# Altium schematic sheet 1.SchDoc
size A3; Author: Sofian Jafar; Engineer: Sofian Jafar; DocumentNumber: 1; Revision: 1.0; SheetNumber: 1; SheetTotal: 1; Descripition: HV+Pulser Board; SheetDescription: UltraSound Pulser
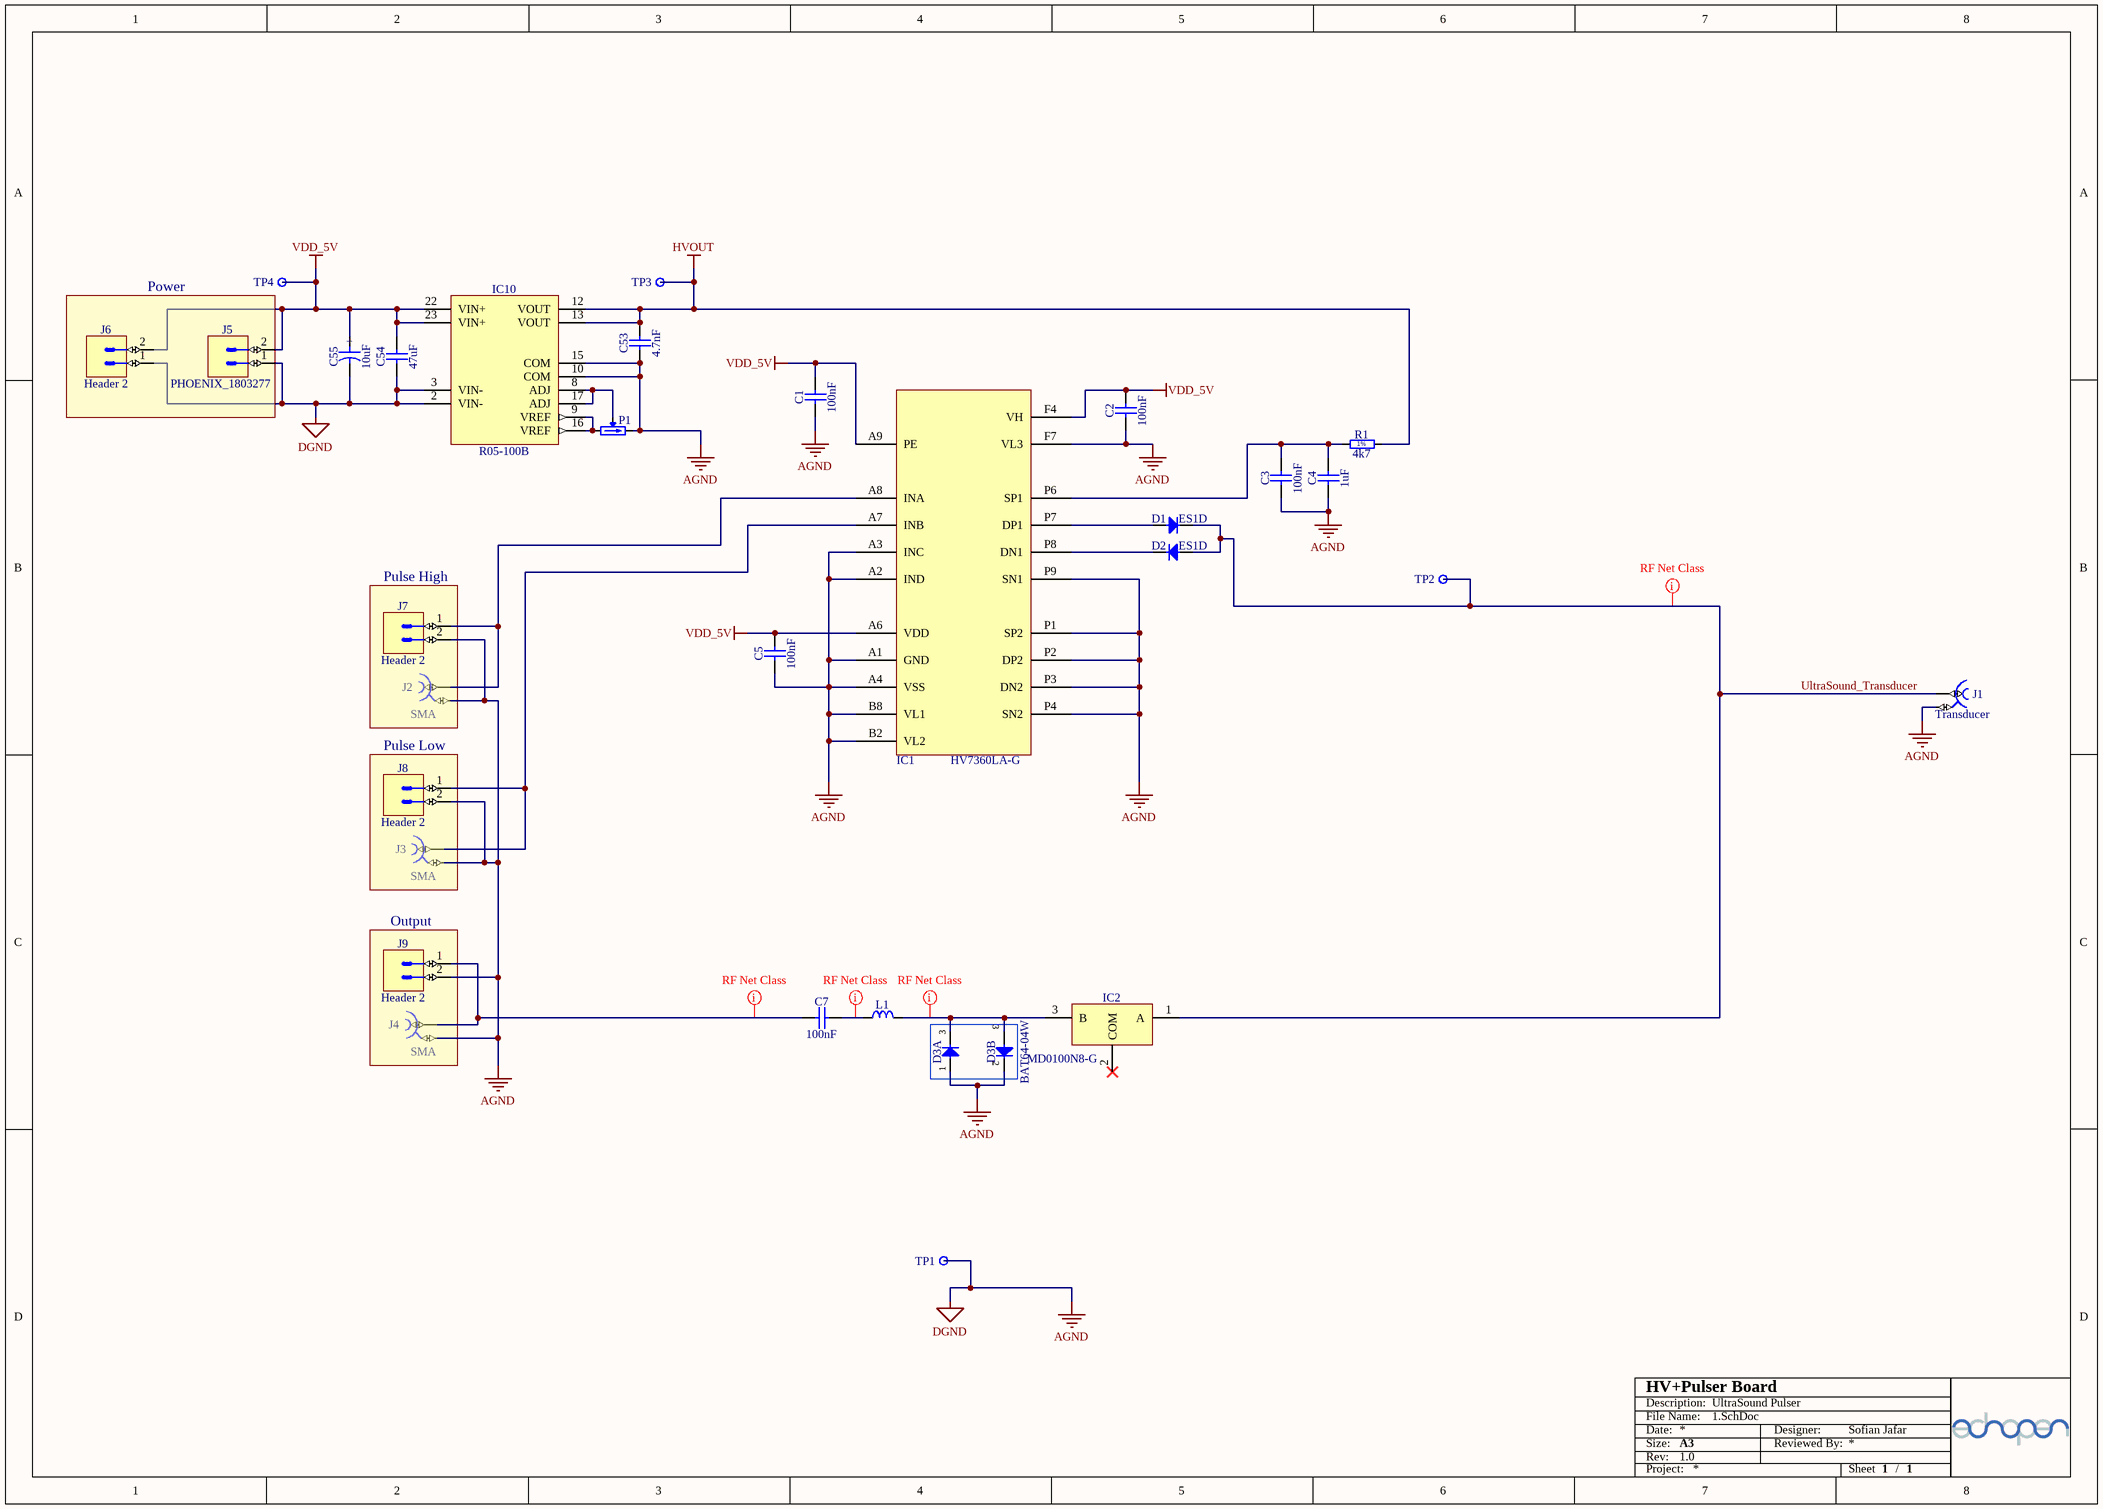
[diagram p0: 1.SchDoc]

## Parts
C1  100nF  [CAPC1608X87N]
C2  100nF  [CAPC1608X87N]
C3  100nF  [CAPC1608X87N]
C4  1uF  [CAPC5650X165N]
C5  100nF  [CAPC1608X87N]
C7  100nF  [CAPC1608X87N]
C53  4.7nF  [CAPC2012X110N]
C54  47uF  [CAPC3216X180N]
C55  10uF  [CAPMP3528X210N]
D1  ES1D  [DIOM5027X244N]
D2  ES1D  [DIOM5027X244N]
D3  BAT64-04W  [SOT65P210X100-3N]  (parts A,B of 2)
IC1  HV7360LA-G  [HV7360]
IC2  MD0100N8-G  [SOT89]
IC10  R05-100B  [PWS_RECOM_R05-100B]
J1  Transducer  [AMPHENOL_132357-11]
J2  SMA  [AMPHENOL_132357-11]
J3  SMA  [AMPHENOL_132357-11]
J4  SMA  [AMPHENOL_132357-11]
J5  PHOENIX_1803277  [PHOENIX_1803277]
J6  Header 2  [HARWIN_M20-9990246]
J7  Header 2  [HARWIN_M20-9990246]
J8  Header 2  [HARWIN_M20-9990246]
J9  Header 2  [HARWIN_M20-9990246]
L1  75R@100MHz  [INDC2012X105N]  (value not drawn)
P1  5k  [TRIM_BOURNS_3223W]  (value not drawn)
R1  4k7  [RESC3216X65N]
TP1  Test Point  [NICOMATIC_C12000B]  (value not drawn)
TP2  Test Point  [NICOMATIC_C12000B]  (value not drawn)
TP3  Test Point  [NICOMATIC_C12000B]  (value not drawn)
TP4  Test Point  [NICOMATIC_C12000B]  (value not drawn)

## Blocks framed on the sheet
Power: J5 J6
Pulse High: J2 J7
Pulse Low: J3 J8
Output: J4 J9

## Nets
AGND: C1.1 C2.1 C3.1 C4.1 C5.1 C53.1 C54.1 C55.2 D3.1(A) D3.2(C) IC1.A1(GND) IC1.A2(IND) IC1.A3(INC) IC1.A4(VSS) IC1.B2(VL2) IC1.B8(VL1) IC1.F7(VL3) IC1.P1(SP2) IC1.P2(DP2) IC1.P3(DN2) IC1.P4(SN2) IC1.P9(SN1) IC10.2(VIN-) IC10.3(VIN-) IC10.10(COM) IC10.15(COM) J1.2 J2.2 J3.2 J4.2 J5.1 J6.1 J7.2 J8.2 J9.2 P1.3(CW) TP1.1  [also labelled DGND]
HVOUT: C53.2 IC10.12(VOUT) IC10.13(VOUT) R1.2 TP3.1
VDD_5V: C1.2 C2.2 C5.2 C54.2 C55.1 IC1.A6(VDD) IC1.A9(PE) IC1.F4(VH) IC10.22(VIN+) IC10.23(VIN+) J5.2 J6.2 TP4.1
UltraSound_Transducer: D1.1(C) D2.2(A) IC2.1(A) J1.1 TP2.1
NetC3_2: C3.2 C4.2 IC1.P6(SP1) R1.1
NetC7_1: C7.1 L1.1
NetC7_2: C7.2 J4.1 J9.1
NetD1_2: D1.2(A) IC1.P7(DP1)
NetD2_1: D2.1(C) IC1.P8(DN1)
NetD3_3: D3.3(COMAC) IC2.3(B) L1.2
NetIC1_A7: IC1.A7(INB) J3.1 J8.1
NetIC1_A8: IC1.A8(INA) J2.1 J7.1
NetIC10_8: IC10.8(ADJ) IC10.17(ADJ) P1.2(W)
NetIC10_9: IC10.9(VREF) IC10.16(VREF) P1.1(CCW)

Not connected (* = marked no-connect by the designer): IC2 2(COM)*

## Layout directives
net class RF: NetC7_1, NetC7_2, NetD3_3, UltraSound_Transducer

## Notes on the sheet
- File Name:
- Date:
- Rev:
- Description:
- Size:
- A3
- Designer:
- Reviewed By:
- Project:
- Sheet
- /
- (in symbol CTE3528-21_10UF_16V_10%_LESR0800) +
- (in symbol R1206_4K7_1%_0.25W_100PPM) 1%

## Library data of the parts
C1-C3 C5 C7 = CC0603_100NF_50V_10%_X7R: Non-polarised capacitor; Part Description: SMD Multilayer Chip Ceramic Capacitor; Manufacturer: GENERIC; Manufacturer1 Part Number: 223858615649; Voltage: 50V; TC: X7R; Tolerance: ±10%; Table: Capacitors SMD; Part Number: CC0603_100NF_50V_10%_X7R; Component Kind: Standard; Component Type: Standard; Pin Count: 2; Value: 100nF; Status: Preferred; Manufacturer Part Number: CC0603_100NF_50V_10%_X7R; Case: 0603; Mounted: Yes; Socket: No; SMD: Yes; Manufacturer1 Example: PHYCOMP; Manufacturer1 ComponentHeight: 0.87mm; HelpURL: \\cern.ch\dfs\Applications\Altium\Datasheets\CC0603_X7R_PHYCOMP.pdf; Author: CERN DEM JLC; CreateDate: 12/3/2007; LatestRevisionDate: 12/3/2007
C4 = CC2220_1UF_200V_10%_X7R: Non-polarised capacitor; Part Description: SMD Ceramic Chip Capacitor; Manufacturer: GENERIC; Manufacturer1 Part Number: C2220X105K2RAC; Voltage: 200V; TC: X7R; Tolerance: ±10%; Table: Capacitors SMD; Part Number: CC2220_1UF_200V_10%_X7R; Component Kind: Standard; Component Type: Standard; Pin Count: 2; Value: 1uF; Status: None; Manufacturer Part Number: CC2220_1UF_200V_10%_X7R; Case: 2220; Mounted: Yes; Socket: No; SMD: Yes; Manufacturer1 Example: KEMET; Manufacturer1 ComponentHeight: 1.65mm; HelpURL: \\cern.ch\dfs\Applications\Altium\Datasheets\CC2220_X7R_KEMET.pdf; Author: CERN DEM JLC; CreateDate: 9/16/2009; LatestRevisionDate: 9/16/2009
C53 = CC0805_4.7NF_250V_10%_X7R: Non-polarised capacitor; Part Description: SMD Multilayer Chip Ceramic Capacitor; Manufacturer: GENERIC; Manufacturer1 Part Number: GRM21AR72E472KW01D; Voltage: 250V; TC: X7R; Tolerance: ±10%; Table: Capacitors SMD; Part Number: CC0805_4.7NF_250V_10%_X7R; Component Kind: Standard; Component Type: Standard; Pin Count: 2; Value: 4.7nF; Status: Preferred; Manufacturer Part Number: CC0805_4.7NF_250V_10%_X7R; Case: 0805; Mounted: Yes; Socket: No; SMD: Yes; Manufacturer1 Example: MURATE; Manufacturer1 ComponentHeight: 1.1mm; Author: S. Jafar; CreateDate: 12/21/2015; LatestRevisionDate: 1/10/2016
C54 = CC1206_47UF_25V_20%_X5R: Non-polarised capacitor; Part Description: SMD Multilayer Chip Ceramic Capacitor; Manufacturer: TDK; Manufacturer Part Number: C3216X5R1E476M160AC; Voltage: 25V; TC: X5R; Tolerance: ±20%; Table: Capacitors SMD; Part Number: CC1206_47UF_25V_20%_X5R; Component Kind: Standard; Component Type: Standard; Pin Count: 2; Value: 47uF; Status: None; Case: 1206; Mounted: Yes; Socket: No; SMD: Yes; ComponentHeight: 1.8mm; HelpURL: \\cern.ch\dfs\Applications\Altium\Datasheets\CC1206_X5R_TDK_C.pdf; Author: CERN DEM JLC; CreateDate: 11/20/2013; LatestRevisionDate: 11/20/2013
C55 = CTE3528-21_10UF_16V_10%_LESR0800: Polarised capacitor; Part Description: Low ESR 0R8 Solid Tantalum Chip Capacitor; Manufacturer: GENERIC; Manufacturer1 Part Number: TPSB106K016R0800; Voltage: 16V; Tolerance: ±10%; Table: Capacitors SMD; Part Number: CTE3528-21_10UF_16V_10%_LESR0800; Component Kind: Standard; Component Type: Standard; Pin Count: 2; Value: 10uF; Status: Preferred; Manufacturer Part Number: CTE3528-21_10UF_16V_10%_LESR0800; Case: B; Mounted: Yes; Socket: No; SMD: Yes; Manufacturer1 Example: AVX; Manufacturer1 ComponentHeight: 2.1mm; HelpURL: \\cern.ch\dfs\Applications\Altium\Datasheets\CTE-LESR_AVX_TPS.pdf; Author: CERN DEM JLC; CreateDate: 5/5/2008; LatestRevisionDate: 1/20/2009
D1 D2 = ES1D: Diode; Part Description: Fast Rectifier; Manufacturer: FAIRCHILD SEMICONDUCTOR; Voltage: 200V; Power: 1A; Table: Diodes; Part Number: ES1D; Component Kind: Standard; Component Type: Standard; Device: ES1D; PackageDescription: DO-214-AC/SMA  Molded Diode, Body 5.0x2.7mm, IPC Medium Density; Manufacturer Part Number: ES1D; Pin Count: 2; Case: DO-214AC; Mounted: Yes; Socket: No; SMD: Yes; ComponentHeight: 2.44mm; HelpURL: \\cern.ch\dfs\Applications\Altium\Datasheets\ES1D.pdf; Author: CERN DEM JLC; CreateDate: 5/6/2008; LatestRevisionDate: 5/6/2008
D3 = BAT64-04W: Serial Diode; Part Description: Silicon Schottky Double Diode; Manufacturer: INFINEON; Voltage: 40V; Power: 250mW; Table: Diodes; Part Number: BAT64-04W; Component Kind: Standard; Component Type: Standard; Device: BAT64-04W; PackageDescription: SOT323, 0.65mm pitch; 3 pin, 1.25mm W X 2.00mm L, IPC Medium Density; Manufacturer Part Number: BAT64-04W; Pin Count: 3; Case: SOT323; Mounted: Yes; Socket: No; SMD: Yes; ComponentHeight: 1mm; HelpURL: \\cern.ch\dfs\Applications\Altium\Datasheets\BAT64-04W.pdf; Author: CERN DEM JMW; CreateDate: 1/8/2009; LatestRevisionDate: 1/8/2009
IC1 = HV7360LA-G: Part Description: High Speed, ±100V 2.5A Two or Three Level Ultrasound Pulser; Manufacturer: Supertex inc.; Table: Analog & Interface; Part Number: HV7360LA-G; Component Kind: Standard; Component Type: Standard; Device: HV7360LA-G; PackageDescription: High Speed, ±100V 2.5A Two or Three Level Ultrasound Pulser; Manufacturer Part Number: HV7360LA-G; Pin Count: 22; Case: LFGA-22; Mounted: Yes; Socket: No; SMD: Yes; ComponentHeight: 0.85; Author: S. Jafar; CreateDate: 12/20/2015; LatestRevisionDate: 1/6/2016
IC2 = MD0100N8-G: 3-Ultra-Sound HV Switch 1=A 2=COM 3=B; Manufacturer: Supertex inc.; Table: Analog & Interface; Part Number: MD0100N8-G; Component Kind: Standard; Component Type: Standard; Device: MD0100N8-G; PackageDescription: SOT89-3, 3-Leads, Body 2.44x4.5mm; Part Description: Ultra-Sound HV Switch; Manufacturer Part Number: MD0100N8-G; Pin Count: 4; Case: SOT89; Mounted: Yes; Socket: No; SMD: Yes; ComponentHeight: 1.6mm; Author: S. Jafar; CreateDate: 12/20/2015; LatestRevisionDate: 1/6/2016
IC10 = R05-100B: Power Supply; Part Description: +5VDC to +55-135VDC 5W Power Supply; Manufacturer: RECOM POWER; Table: Power Supplies; Part Number: R05-100B; Component Kind: Standard; Component Type: Standard; Device: R05-100B; PackageDescription: 55-135V 5W Power Supply, Body 32x21mm; Status: None; Manufacturer Part Number: R05-100B; Pin Count: 12; Mounted: Yes; Socket: No; SMD: No; ComponentHeight: 9.4mm; Author: S. Jafar; CreateDate: 12/21/2015; LatestRevisionDate: 12/21/2015
J1-J4 = AMPHENOL_132357-11: Part Description: SMA End Launch Jack for 1.58mm PCB, 50 Ohm, Flat Tab Contact; Part Number: AMPHENOL_132357-11; Component Kind: Standard; Component Type: Standard; Pin Count: 2; Family: SMA; Mounted: Yes; Socket: No; SMD: Yes; Status: None; Manufacturer: AMPHENOL; Manufacturer Part Number: 132357-11; ComponentHeight: 7.92mm; HelpURL: \\cern.ch\dfs\Applications\Altium\Datasheets\AMPHENOL_132357-11.pdf; Author: CERN DEM JLC; CreateDate: 5/14/2012; LatestRevisionDate: 5/14/2012; Table: AMPHENOL
J5 = PHOENIX_1803277: Connector 2 Male; Part Description: 8A 160 V, Pitch: 3.81mm, 2 Positions  Right Angled Header; Manufacturer: PHOENIX CONTACT; Manufacturer Part Number: 1803277 (MC 1,5/ 2-G-3,81); Part Number: PHOENIX_1803277; Component Kind: Standard; Component Type: Standard; Pin Count: 2; Mounted: Yes; Socket: No; SMD: No; Status: None; ComponentHeight: 7.25mm; HelpURL: \\cern.ch\dfs\Applications\Altium\Datasheets\PHOENIX_1803277.pdf; Author: CERN DEM JLC; CreateDate: 5/6/2014; LatestRevisionDate: 5/6/2014; Table: PHOENIX
J6-J9 = HARWIN_M20-9990246_a: Connector 2 Male; Part Description: 2 Contacts SIL Vertical Pin Header, Pitch 2.54mm, Mating Height 6.1mm, Insulator 2.54mm; Manufacturer: HARWIN; Part Number: HARWIN_M20-9990246_a; Component Kind: Standard; Component Type: Standard; Pin Count: 2; Family: Header 2; Mounted: Yes; Socket: No; SMD: No; Status: None; Manufacturer Part Number: M20-9990246; ComponentHeight: 8.68mm; HelpURL: \\cern.ch\dfs\Applications\Altium\Datasheets\HARWIN_M20-9990246.pdf; Author: S. Jafar; CreateDate: 1/25/2016; LatestRevisionDate: 1/25/2016; Table: HARWIN
L1 = IND0805_MURATA_BLM21BB750SN1D: Inductor; Part Description: SMD EMIFIL Suppression Chip Ferrite Bead; Manufacturer: MURATA; Power: 700mA; Resistance: 0.16R; Tolerance: ±25%; Table: Inductors SMD; Part Number: IND0805_MURATA_BLM21BB750SN1D; Component Kind: Standard; Component Type: Standard; Pin Count: 2; Value: 75R@100MHz; Status: None; Manufacturer Part Number: BLM21BB750SN1D; Case: 0805; Mounted: Yes; Socket: No; SMD: Yes; ComponentHeight: 1.05mm; Author: S. Jafar; CreateDate: 12/21/2015; LatestRevisionDate: 12/21/2015
P1 = TRIM_11T_5K_BOURNS_3223W-1-502E: Trimming Potentiometer; Part Description: 11 Turns SMD Trimpot® Trimming Potentiometer (Top Adjust); Manufacturer: BOURNS; Power: 0.125W; TC: ±100ppm/°C; Tolerance: ±20%; Table: Potentiometers SMD; Part Number: TRIM_11T_5K_BOURNS_3223W-1-502E; Component Kind: Standard; Component Type: Standard; Pin Count: 3; Value: 5k; Manufacturer Part Number: 3223W-1-502E; Case: 3223W; Mounted: Yes; Socket: No; SMD: Yes; ComponentHeight: 4.16mm; HelpURL: \\cern.ch\dfs\Applications\Altium\Datasheets\TRIM_BOURNS_3223W.pdf; Author: CERN DEM JLC; CreateDate: 3/31/2011; LatestRevisionDate: 12/18/2012
R1 = R1206_4K7_1%_0.25W_100PPM: Resistor - 1%; Part Description: General Purpose Thick Film Chip Resistor; Manufacturer: GENERIC; Manufacturer1 Part Number: NRC12F4701TRF; Power: 0.25W; TC: ±100ppm/°C; Table: Resistors SMD; Part Number: R1206_4K7_1%_0.25W_100PPM; Component Kind: Standard; Component Type: Standard; Pin Count: 2; Value: 4k7; Status: Preferred; Tolerance: ±1%; Manufacturer Part Number: R1206_4K7_1%_0.25W_100PPM; Case: 1206; Mounted: Yes; Socket: No; SMD: Yes; Manufacturer1 Example: NIC COMPONENT; Manufacturer1 ComponentHeight: 0.65mm; HelpURL: \\cern.ch\dfs\Applications\Altium\Datasheets\R1206_NIC_NRC.pdf; Author: CERN DEM JLC; CreateDate: 12/3/2007; LatestRevisionDate: 3/13/2008
TP1-TP4 = NICOMATIC_C12000B: Part Description: SMD Test Point; Table: Miscellaneous; Part Number: NICOMATIC_C12000B; Component Kind: Standard; Component Type: Standard; Pin Count: 1; Family: Test Point; Mounted: Yes; Socket: No; SMD: Yes; Status: None; Manufacturer: NICOMATIC; Manufacturer Part Number: C12000B; ComponentHeight: 1.5mm; HelpURL: \\cern.ch\dfs\Applications\Altium\Datasheets\NICOMATIC_C12000B.pdf; Author: CERN DEM JLC; CreateDate: 3/25/2009; LatestRevisionDate: 3/25/2009